# Altium schematic sheet NRF2401.SchDoc
size A3; Organization: Altium Limited; Address1: L3, 12a Rodborough Rd; Address2: Frenchs Forest; Address3: NSW; Address4: Australia 2086
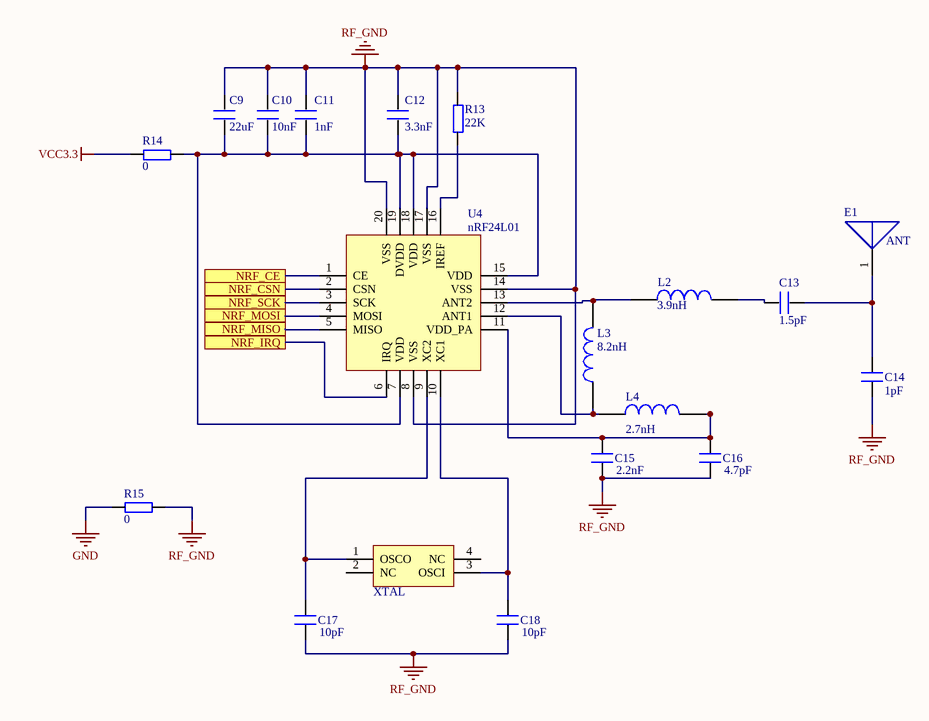
[diagram p0: NRF2401.SchDoc]

## Parts
C9  22uF  [0603P]
C10  10nF  [0603P]
C11  1nF  [0603P]
C12  3.3nF  [0603P]
C13  1.5pF  [0603P]
C14  1pF  [0603P]
C15  2.2nF  [0603P]
C16  4.7pF  [0603P]
C17  10pF  [0603P]
C18  10pF  [0603P]
E1  ANT  [ANT]
L2  INDUCTOR  [0402L]  (value not drawn)
L3  INDUCTOR  [0402L]  (value not drawn)
L4  INDUCTOR  [0402L]  (value not drawn)
R13  22K  [0603P]
R14  0  [0603P]
R15  0  [0603P]
U4  nRF24L01  [QFN20]
XTAL1  XTAL  [SMD-3225_4P]

## Ports
NRF_CE, NRF_CSN, NRF_IRQ, NRF_MISO, NRF_MOSI, NRF_SCK

## Nets
GND: R15.1
RF_GND: C9.1 C10.1 C11.1 C12.1 C14.1 C15.2 C16.2 C17.2 C18.2 R13.2 R15.2 U4.8(VSS) U4.14(VSS) U4.17(VSS) U4.20(VSS)
VCC3.3: R14.1
NRF_CE: U4.1(CE) ; port NRF_CE
NRF_CSN: U4.2(CSN) ; port NRF_CSN
NRF_IRQ: U4.6(IRQ) ; port NRF_IRQ
NRF_MISO: U4.5(MISO) ; port NRF_MISO
NRF_MOSI: U4.4(MOSI) ; port NRF_MOSI
NRF_SCK: U4.3(SCK) ; port NRF_SCK
NetC9_2: C9.2 C10.2 C11.2 C12.2 R14.2 U4.7(VDD) U4.15(VDD) U4.18(VDD) U4.19(DVDD)
NetC13_1: C13.1 L2.2
NetC13_2: C13.2 C14.2 E1.1
NetC15_1: C15.1 C16.1 L4.2 U4.11(VDD_PA)
NetC17_1: C17.1 U4.9(XC2) XTAL1.1(OSCO)
NetC18_1: C18.1 U4.10(XC1) XTAL1.3(OSCI)
NetL2_1: L2.1 L3.2 U4.13(ANT2)
NetL3_1: L3.1 L4.1 U4.12(ANT1)
NetR13_1: R13.1 U4.16(IREF)

Not connected (* = marked no-connect by the designer): XTAL1 2(NC) 4(NC)

## Notes on the sheet
- Title
- Size:
- Date:
- A3
- Number:
- Time:
- Revision:
- Sheet
- of
- File:
- (in symbol INDUCTOR) 3.9nH; 8.2nH; 2.7nH

## Library data of the parts
C9-C18 = C
R13-R15 = R
XTAL1 = XTAL16M: Value: 16MHz
E1 = ANT: Published: 12-August-2017; Publisher: mazhongwei; PackageReference: R_1206